# EAGLE schematic ATMEGA328P-AU Board (EAGLE 9.6.2)
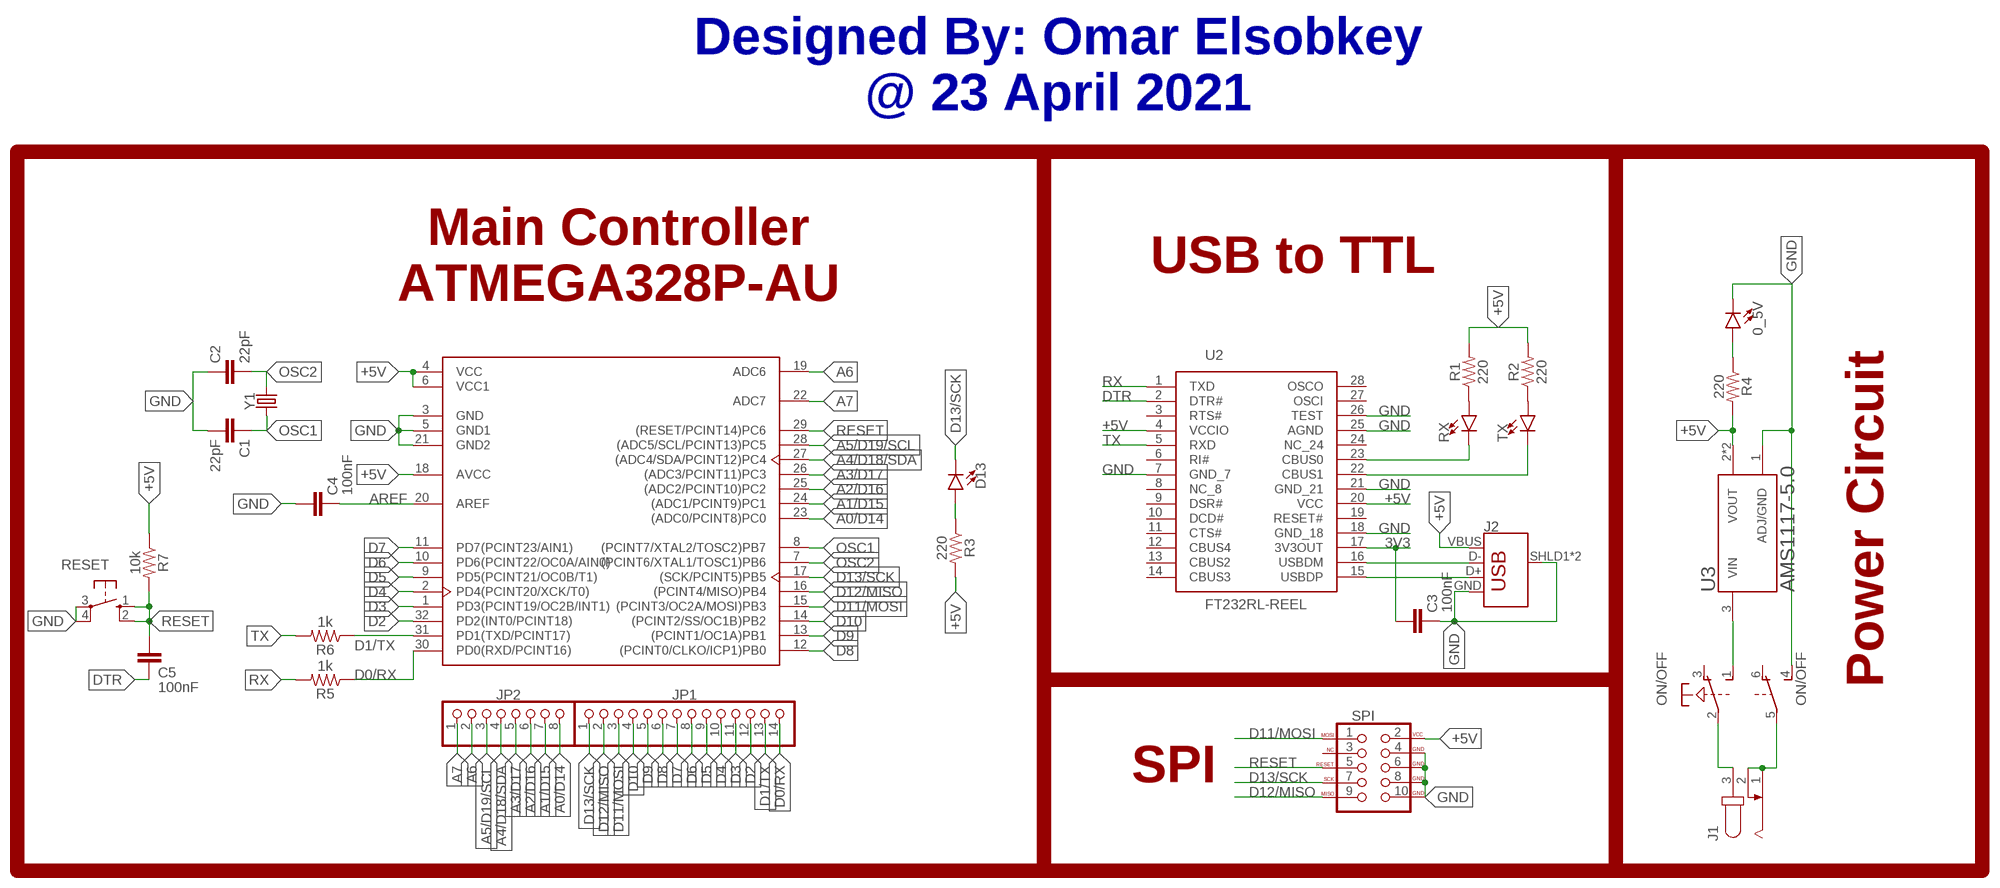
[diagram p0: schematic, sheet 1]

## Parts
0_5V  LED3MM  [LED_3MM]
C1  22pF  22PF-PTH-2.54MM-200V-5%  [CAP-PTH-2.54]
C2  22pF  22PF-PTH-2.54MM-200V-5%  [CAP-PTH-2.54]
C3  100nF  22PF-PTH-2.54MM-200V-5%  [CAP-PTH-2.54]
C4  100nF  22PF-PTH-2.54MM-200V-5%  [CAP-PTH-2.54]
C5  100nF  22PF-PTH-2.54MM-200V-5%  [CAP-PTH-2.54]
D13  LED3MM  [LED_3MM]
J1  JACK-PLUG0  [SPC4077]
J2  USB_B_PTH  [USB-B-PTH]
JP1  PINHD-1X14  [1X14]
JP2  PINHD-1X8  [1X08]
ON/OFF  PVA2R  [PVA2R]
R1  220  RESISTOR1206  [1206]
R2  220  RESISTOR1206  [1206]
R3  220  RESISTOR1206  [1206]
R4  220  RESISTOR1206  [1206]
R5  1k  RESISTOR1206  [1206]
R6  1k  RESISTOR1206  [1206]
R7  10k  RESISTOR1206  [1206]
RESET  10-XX  [B3F-10XX]
RX  LED3MM  [LED_3MM]
SPI  AVR_SPI_PROG_5X2LOCK  [2X5-SHROUDED_LOCK]
TX  LED3MM  [LED_3MM]
U1  ATMEGA328P-AU  [TQFP-32]
U2  FT232RL-REEL  [SSOP-28]
U3  AMS1117-5.0  [AMS1117-5.0]
Y1  CRYSTALPTH-HC49UV  [HC49U]

## Nets
3V3: C3.1 U2.17(3V3OUT)
+5V: J2.VBUS R1.2 R2.2 R3.2 R4.2 R7.1 SPI.2(VCC) U1.4(VCC) U1.6(VCC1) U1.18(AVCC) U2.4(VCCIO) U2.20(VCC) U3.2(VOUT) U3.4(VOUT)
A0/D14: JP2.8 U1.23((ADC0/PCINT8)PC0)
A1/D15: JP2.7 U1.24((ADC1/PCINT9)PC1)
A2/D16: JP2.6 U1.25((ADC2/PCINT10)PC2)
A3/D17: JP2.5 U1.26((ADC3/PCINT11)PC3)
A4/D18/SDA: JP2.4 U1.27((ADC4/SDA/PCINT12)PC4)
A5/D19/SCL: JP2.3 U1.28((ADC5/SCL/PCINT13)PC5)
A6: JP2.2 U1.19(ADC6)
A7: JP2.1 U1.22(ADC7)
AREF: C4.2 U1.20(AREF)
CBUS0: RX.K(C) U2.23(CBUS0)
CBUS1: TX.K(C) U2.22(CBUS1)
D0/RX: JP1.14 R5.1 U1.30(PD0(RXD/PCINT16))
D1/TX: JP1.13 R6.1 U1.31(PD1(TXD/PCINT17))
D2: JP1.12 U1.32(PD2(INT0/PCINT18))
D3: JP1.11 U1.1(PD3(PCINT19/OC2B/INT1))
D4: JP1.10 U1.2(PD4(PCINT20/XCK/T0))
D5: JP1.9 U1.9(PD5(PCINT21/OC0B/T1))
D6: JP1.8 U1.10(PD6(PCINT22/OC0A/AIN0))
D7: JP1.7 U1.11(PD7(PCINT23/AIN1))
D8: JP1.6 U1.12((PCINT0/CLKO/ICP1)PB0)
D9: JP1.5 U1.13((PCINT1/OC1A)PB1)
D10: JP1.4 U1.14((PCINT2/SS/OC1B)PB2)
D11/MOSI: JP1.3 SPI.1(MOSI) U1.15((PCINT3/OC2A/MOSI)PB3)
D12/MISO: JP1.2 SPI.9(MISO) U1.16((PCINT4/MISO)PB4)
D13/SCK: D13.K(C) JP1.1 SPI.7(SCK) U1.17((SCK/PCINT5)PB5)
DTR: C5.2 U2.2(DTR#)
GND: 0_5V.K(C) C1.2 C2.1 C3.2 C4.1 J2.GND J2.SHLD1(SHIELD) J2.SHLD2(SHIELD) ON/OFF.4(2:S) RESET.3(P) RESET.4(P1) SPI.4(GND) SPI.6(GND) SPI.8(GND) SPI.10(GND) U1.3(GND) U1.5(GND1) U1.21(GND2) U2.7(GND_7) U2.18(GND_18) U2.21(GND_21) U2.25(AGND) U2.26(TEST) U3.1(ADJ/GND)
N$1: R1.1 RX.A
N$2: R2.1 TX.A
N$3: J1.3 ON/OFF.2(1:P)
N$4: D13.A R3.1
N$5: J2.D- U2.16(USBDM)
N$6: J1.1 J1.2 ON/OFF.5(2:P)
N$8: ON/OFF.1(1:S) U3.3(VIN)
N$9: 0_5V.A R4.1
OSC1: C1.1 U1.8((PCINT7/XTAL2/TOSC2)PB7) Y1.1
OSC2: C2.2 U1.7((PCINT6/XTAL1/TOSC1)PB6) Y1.2
RESET: C5.1 R7.2 RESET.1(S) RESET.2(S1) SPI.5(RESET) U1.29((RESET/PCINT14)PC6)
RX: R5.2 U2.1(TXD)
TX: R6.2 U2.5(RXD)
USBDP: J2.D+ U2.15(USBDP)
Unconnected: ON/OFF.3(1:O) ON/OFF.6(2:O) SPI.3(NC) U2.3(RTS#) U2.6(RI#) U2.8(NC_8) U2.9(DSR#) U2.10(DCD#) U2.11(CTS#) U2.12(CBUS4) U2.13(CBUS2) U2.14(CBUS3) U2.19(RESET#) U2.24(NC_24) U2.27(OSCI) U2.28(OSCO)

## Notes on the sheet
- Designed By: Omar Elsobkey
  @ 23 April 2021
- Main Controller
  ATMEGA328P-AU
- USB to TTL
- Power Circuit
- SPI

## Library data of the parts
0_5V D13 RX TX = SparkFun-LED:LED: LED (Generic) Standard schematic elements and footprints for 5mm, 3mm, 1206, and 0603 sized LEDs. Generic LEDs with no color specified.; PROD_ID: DIO-08794
C1 C2 = SparkFun-Capacitors:22PF: 22pF ceramic capacitors A capacitor is a passive two-terminal electrical component used to store electrical energy temporarily in an electric field.; PROD_ID: CAP-09128
C3-C5 = SparkFun-Capacitors:22PF: 22pF ceramic capacitors A capacitor is a passive two-terminal electrical component used to store electrical energy temporarily in an electric field.; PROD_ID: CAP-09128; VALUE: 22pF
J1 = con-jack:JACK-PLUG: DC POWER JACK Power Jack, DC, Right Angle, Through Hole, Rated 5A at 16VDC, PC Terminals Distributor: Farnell (www.Farnell.de) Drawing: 84N1161.pdf / 84N1162.pdf Manufacturer: SPC Technology (www.spctechnology.com) Type: SPC4077 / SPC 4078; OC_FARNELL: unknown; OC_NEWARK: unknown
J2 = SparkFun-Connectors:USB_B: USB Type B Connector SparkFun Products: SparkFun Stepoko <https://www.sparkfun.com/products/13899> PTH; PROD_ID: CONN-08278; SF_ID: PRT-00139
JP1 = pinhead:PINHD-1X14: PIN HEADER
JP2 = pinhead:PINHD-1X8: PIN HEADER
ON/OFF = switch-misc:PVA2R: ITT SWITCH
R1-R7 = SparkFun-Resistors:RESISTOR: Generic Resistor Package
RESET = switch-omron:10-XX: OMRON SWITCH; MPN: B3F-1000; OC_FARNELL: 176432; OC_NEWARK: 36M3542
SPI = SparkFun-Connectors:AVR_SPI_PROG_5X2: AVR 10-pin ICSP Header This is the standard AVR In Circuit Serial Programming header. Minimal, but includes pin one indicator. Works with standard Olimex programmers. SparkFun Products: 2x5 AVR ICSP Male Header <https://www.sparkfun.com/products/778> - PTH 2x5 Pin Shrouded Header <https://www.sparkfun.com/products/8506> - PTH2; PROD_ID: CONN-08671; SF_ID: PRT-08506
U1 = Microcontroller:ATMEGA328P-AU: IC MCU 8BIT 32KB FLASH 32TQFP Manufacturer's datasheet <http://ww1.microchip.com/downloads/en/DeviceDoc/ATmega48A-PA-88A-PA-168A-PA-328-P-DS-DS40002061A.pdf>; CREATED_BY: PCBLayout.com; DIGIKEY_PART_NUMBER: ATMEGA328P-AU-ND; MANUFACTURER: Microchip Technology; MPN: ATMEGA328P-AU; PACKAGE: TQFP-32
U2 = IC:FT232RL-REEL: IC USB FS SERIAL UART 28-SSOP Manufacturer's datasheet <https://www.ftdichip.com/Support/Documents/DataSheets/ICs/DS_FT232R.pdf>; CREATED_BY: PCBLayout.com; DIGI-KEYPARTNUMBER: 768-1007-1-ND; MANUFACTURER: FTDI, Future Technology Devices International Ltd; MPN: FT232RL-REEL; PACKAGE: 28-SSOP
U3 = AMS1117-5.0:AMS1117-5.0: Sot223/Pkg 1-Amp 5-Volt Low Drop Out Voltage Regulatator; AVAILABILITY: Unavailable; DESCRIPTION: Sot223/Pkg 1-Amp 5-Volt Low Drop Out Voltage Regulatator; MF: Advanced Monolithic Systems; MP: AMS1117-5.0; PACKAGE: None; PRICE: None
Y1 = SparkFun-Clocks:CRYSTAL: Crystals (Generic) These are passive quartz crystals, which can be used as a clock source for a microcontroller. Crystal's are two-terminal devices. They require external "load" capacitors to generate an oscillating signal.